# EAGLE schematic power (EAGLE 6.5.0)

## Sheet 1 of 2
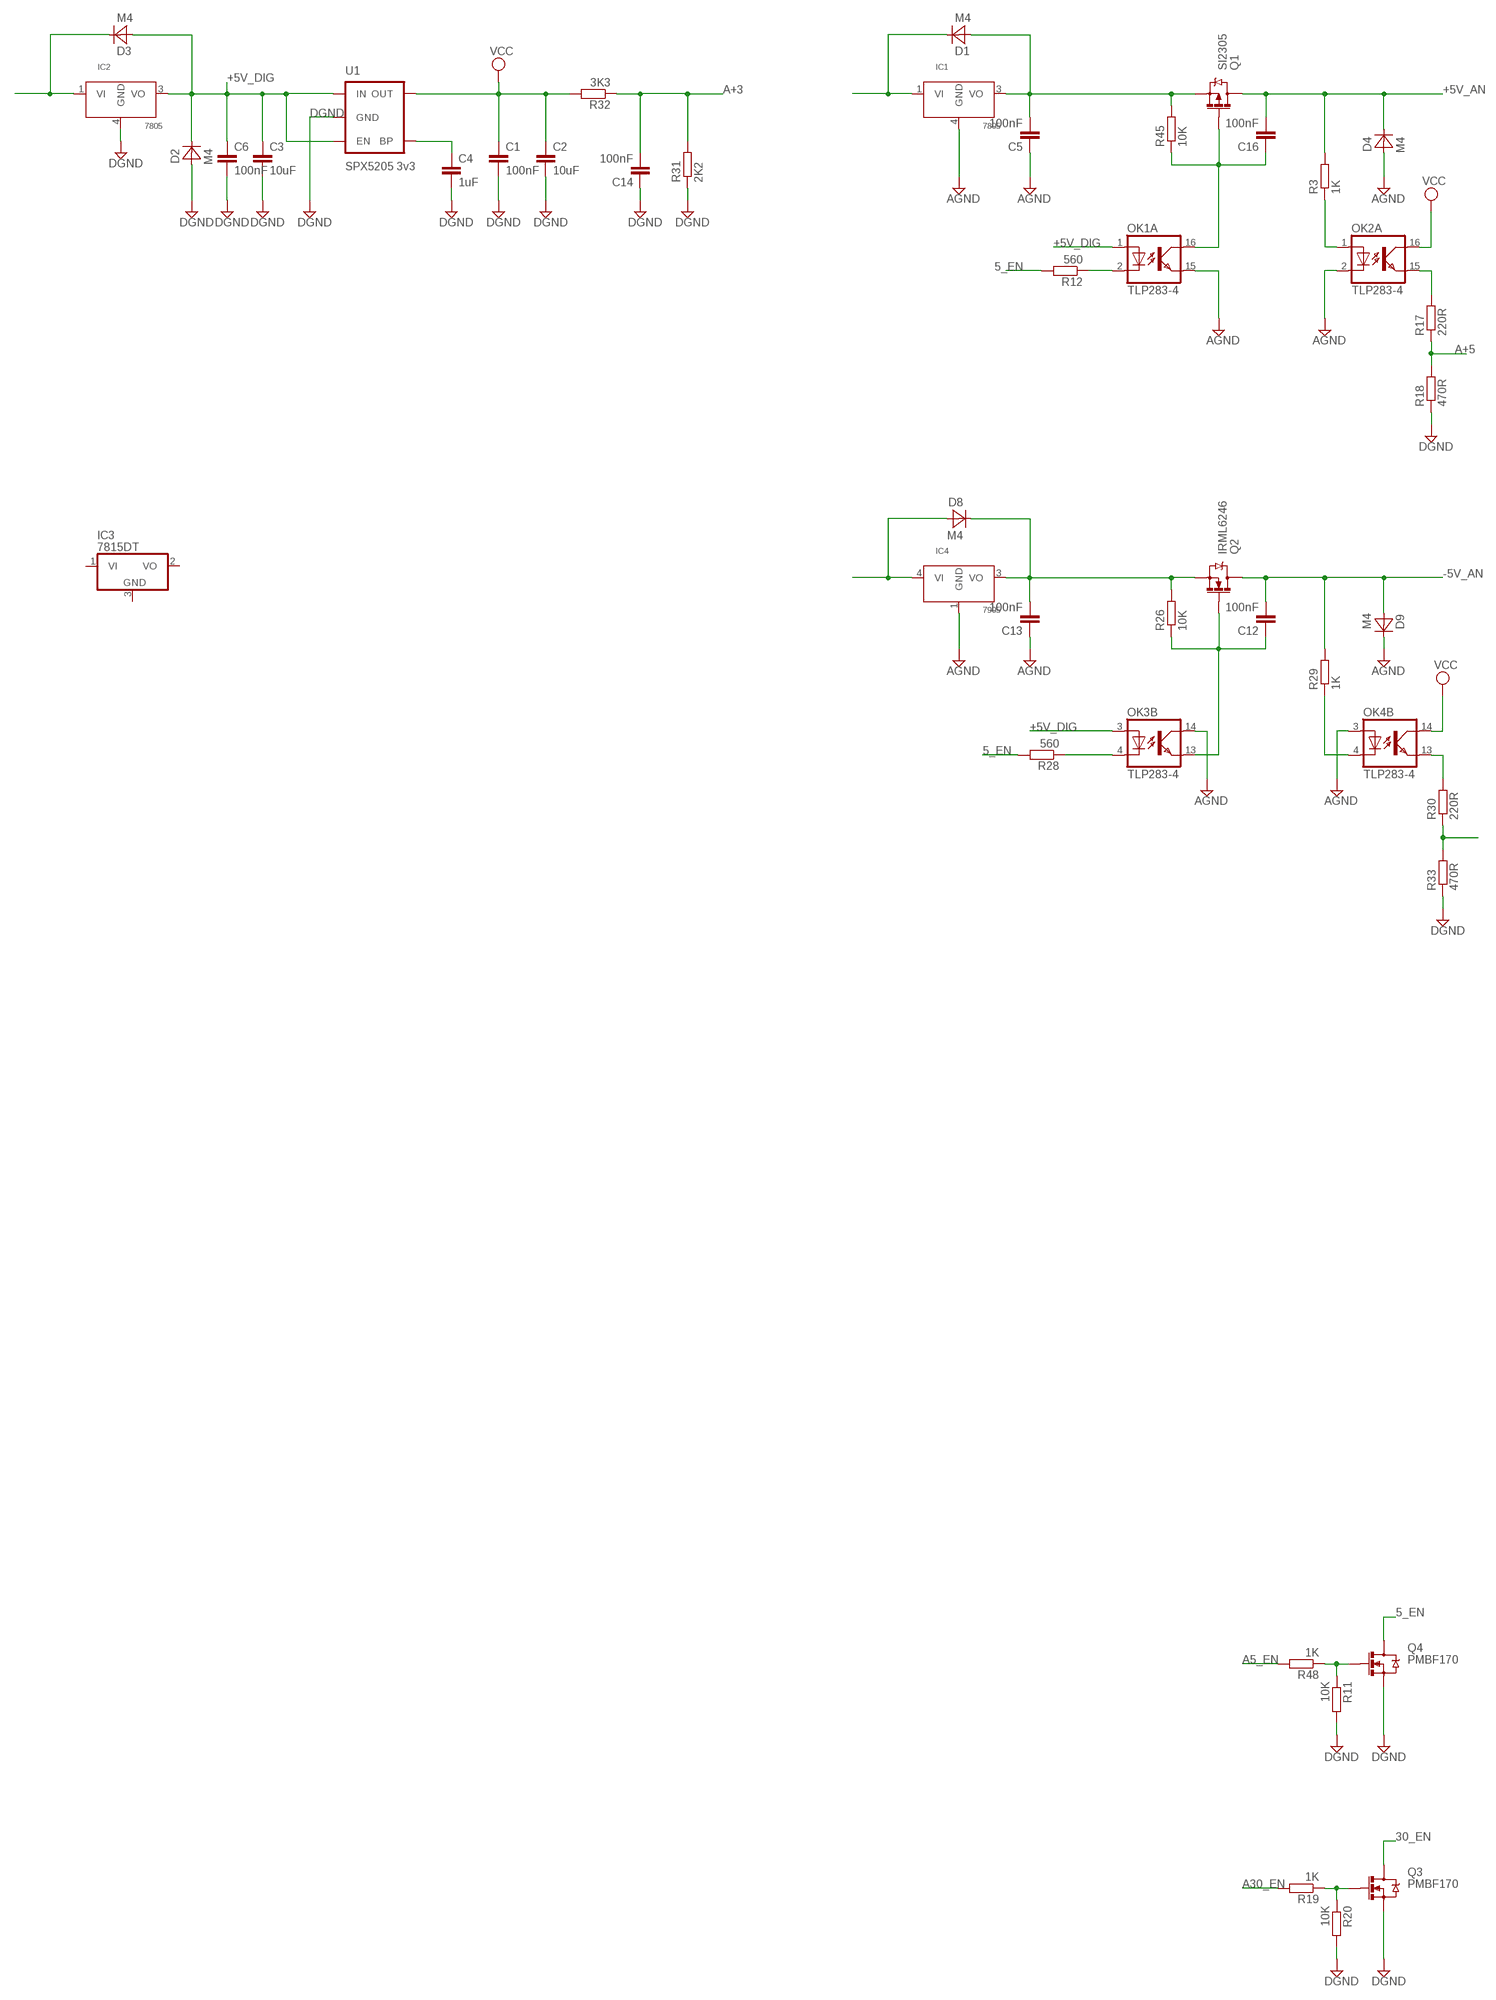
[diagram p0: schematic, sheet 1, part 1 of 2]
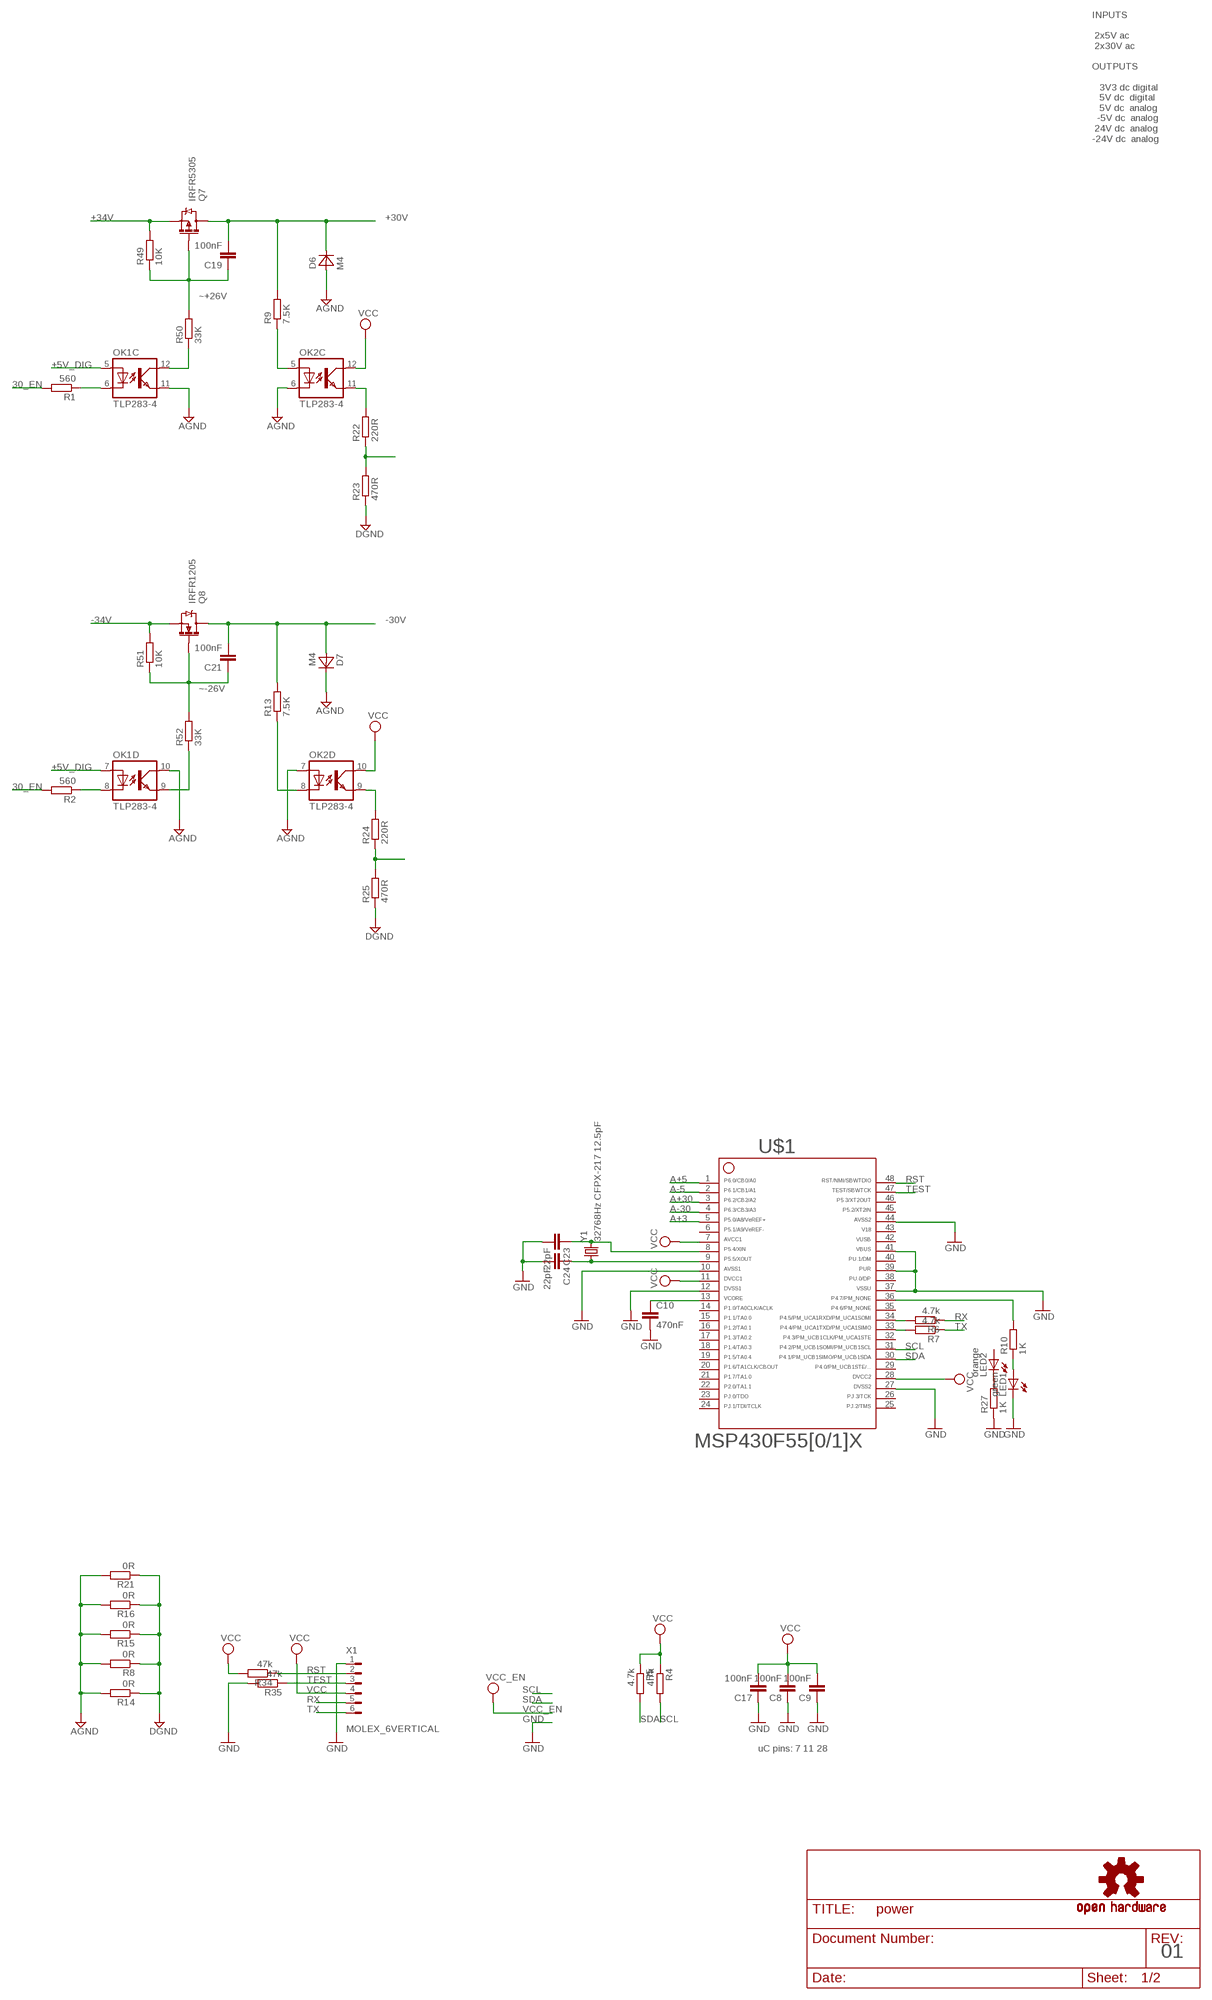
[diagram p1: schematic, sheet 1, part 2 of 2]

### Parts
C1  100nF  C-EUC0805  [C0805]
C2  10uF  C-EUC1206  [C1206]
C3  10uF  C-EUC1206  [C1206]
C4  1uF  C-EUC0805  [C0805]
C5  100nF  C-EUC0805  [C0805]
C6  100nF  C-EUC0805  [C0805]
C8  100nF  C-EUC0805  [C0805]
C9  100nF  C-EUC0805  [C0805]
C10  470nF  C-EUC0805  [C0805]
C12  100nF  C-EUC0805  [C0805]
C13  100nF  C-EUC0805  [C0805]
C14  100nF  C-EUC0805  [C0805]
C16  100nF  C-EUC0805  [C0805]
C17  100nF  C-EUC0805  [C0805]
C19  100nF  C-EUC0805  [C0805]
C21  100nF  C-EUC0805  [C0805]
C23  22pF  C-EUC0805  [C0805]
C24  22pF  C-EUC0805  [C0805]
D1  M4  MBRA340T3  [SMA]
D2  M4  MBRA340T3  [SMA]
D3  M4  MBRA340T3  [SMA]
D4  M4  MBRA340T3  [SMA]
D6  M4  MBRA340T3  [SMA]
D7  M4  MBRA340T3  [SMA]
D8  M4  MBRA340T3  [SMA]
D9  M4  MBRA340T3  [SMA]
IC1  7805  78XX  [D2PACK]
IC2  7805  78XX  [D2PACK]
IC3  7815DT  [TO252]
IC4  7905  79XX  [D2PACK]
LED1  green  LEDCHIP-LED0805  [CHIP-LED0805]
LED2  orange  LEDCHIP-LED0805  [CHIP-LED0805]
OK1  TLP283-4  [MINI-FLAT-16]
OK2  TLP283-4  [MINI-FLAT-16]
OK3  TLP283-4  [MINI-FLAT-16]
OK4  TLP283-4  [MINI-FLAT-16]
Q1  SI2305  MOSFET-PCHANNEL_SOT23-3_POWER  [SOT23-3_POWER]
Q2  IRML6246  MOSFET-NCHANNEL_SOT23-3_POWER  [SOT23-3_POWER]
Q3  PMBF170  MOSFET-NCHANNEL_SOT23-3  [SOT23-3]
Q4  PMBF170  MOSFET-NCHANNEL_SOT23-3  [SOT23-3]
Q7  IRFR5305  MOSFET-PCHANNEL_D-PAK  [D-PAK_TO252AA]
Q8  IRFR1205  MOSFET-NCHANNEL_D-PAK  [D-PAK_TO252AA]
R1  560  R-EU_R0805W  [R0805W]
R2  560  R-EU_R0805W  [R0805W]
R3  1K  R-EU_R0805W  [R0805W]
R4  4.7k  R-EU_R0805W  [R0805W]
R5  4.7k  R-EU_R0805W  [R0805W]
R6  4.7k  R-EU_R0805W  [R0805W]
R7  4.7k  R-EU_R0805W  [R0805W]
R8  0R  R-EU_R0805W  [R0805W]
R9  7.5K  R-EU_R0805W  [R0805W]
R10  1K  R-EU_R0805W  [R0805W]
R11  10K  R-EU_R0805W  [R0805W]
R12  560  R-EU_R0805W  [R0805W]
R13  7.5K  R-EU_R0805W  [R0805W]
R14  0R  R-EU_R0805W  [R0805W]
R15  0R  R-EU_R0805W  [R0805W]
R16  0R  R-EU_R0805W  [R0805W]
R17  220R  R-EU_R0805W  [R0805W]
R18  470R  R-EU_R0805W  [R0805W]
R19  1K  R-EU_R0805W  [R0805W]
R20  10K  R-EU_R0805W  [R0805W]
R21  0R  R-EU_R0805W  [R0805W]
R22  220R  R-EU_R0805W  [R0805W]
R23  470R  R-EU_R0805W  [R0805W]
R24  220R  R-EU_R0805W  [R0805W]
R25  470R  R-EU_R0805W  [R0805W]
R26  10K  R-EU_R0805W  [R0805W]
R27  1K  R-EU_R0805W  [R0805W]
R28  560  R-EU_R0805W  [R0805W]
R29  1K  R-EU_R0805W  [R0805W]
R30  220R  R-EU_R0805W  [R0805W]
R31  2K2  R-EU_R0805W  [R0805W]
R32  3K3  R-EU_R0805W  [R0805W]
R33  470R  R-EU_R0805W  [R0805W]
R34  47k  R-EU_R0805W  [R0805W]
R35  47k  R-EU_R0805W  [R0805W]
R45  10K  R-EU_R0805W  [R0805W]
R48  1K  R-EU_R0805W  [R0805W]
R49  10K  R-EU_R0805W  [R0805W]
R50  33K  R-EU_R0805W  [R0805W]
R51  10K  R-EU_R0805W  [R0805W]
R52  33K  R-EU_R0805W  [R0805W]
U1  SPX5205 3v3  V_REG_LDOSMD  [SOT23-5]
U$1  F55[0/1]X---PT48  [PT48]
U$7  OSHW-LOGOM  [OSHW-LOGO-M]
X1  MOLEX_6VERTICAL  [0530470610]
Y1  32768Hz CFPX-217 12.5pF  CRYSTAL3.2X1.5  [CRYSTAL-SMD-3.2X1.5]

### Nets
5_EN: Q4.3(D) R12.2 R28.2
30_EN: Q3.3(D) R1.2 R2.2
$N2: C13.2 D8.C IC4.3(VO) Q2.2(S) R26.2
$N333: C5.2 D1.A IC1.3(VO) Q1.2(S) R45.2
+5V_AN: C16.2 D4.C Q1.3(D) R3.2
+5V_DIG: C3.1 C6.1 D2.C D3.A IC2.3(VO) OK1.1(A:A) OK1.5(C:A) OK1.7(D:A) OK3.3(B:A) U1.1(IN) U1.3(EN)
+30V: C19.2 D6.C Q7.2(D) R9.2
-5V_AN: C12.2 D9.A Q2.3(D) R29.2
-30V: C21.2 D7.A Q8.2(D) R13.2
A5_EN: R48.2
A30_EN: R19.2
A+3: C14.2 R31.2 R32.1 U$1.5
A+5: R17.1 R18.2 U$1.1
A+30: U$1.3
A-5: U$1.2
A-30: U$1.4
AGND: C5.1 C13.1 D4.A D6.A D7.C D9.C IC1.4(GND) IC4.1(GND) OK1.10(D:COL) OK1.11(C:EMIT) OK1.15(A:EMIT) OK2.2(A:C) OK2.6(C:C) OK2.7(D:A) OK3.14(B:COL) OK4.3(B:A) R8.2 R14.2 R15.2 R16.2 R21.2
DGND: C1.2 C2.2 C3.2 C4.2 C6.2 C14.1 D2.A IC2.4(GND) Q3.2(S) Q4.2(S) R8.1 R11.2 R14.1 R15.1 R16.1 R18.1 R20.2 R21.1 R23.1 R25.1 R31.1 R33.1 U1.2(GND)
GND: C8.1 C9.1 C10.2 C17.1 C23.2 C24.2 LED1.C R27.1 R35.2 U$1.10 U$1.12 U$1.27 U$1.37 U$1.39 U$1.41 U$1.44 X1.1
LED: R10.2 U$1.36
N$1: LED1.A R10.1
N$2: C4.1 U1.4(BP)
N$3: D1.C IC1.1(VI)
N$5: Q4.1(G) R11.1 R48.1
N$6: C10.1 U$1.13
N$8: OK1.2(A:C) R12.1
N$10: OK1.8(D:C) R2.1
N$11: R6.2 U$1.34
N$12: OK2.1(A:A) R3.1
N$13: R7.2 U$1.33
N$15: OK2.5(C:A) R9.1
N$16: OK2.8(D:C) R13.1
N$18: Q3.1(G) R19.1 R20.1
N$19: OK1.6(C:C) R1.1
N$20: D3.C IC2.1(VI)
N$21: OK2.15(A:EMIT) R17.2
N$22: C12.1 OK3.13(B:EMIT) Q2.1(G) R26.1
N$25: C24.1 U$1.9 Y1.P$1
N$26: C23.1 U$1.8 Y1.P$2
N$27: OK2.11(C:EMIT) R22.2
N$28: R22.1 R23.2
N$29: OK2.9(D:EMIT) R24.2
N$30: R24.1 R25.2
N$31: D8.A IC4.4(VI)
N$32: OK3.4(B:C) R28.1
N$33: OK4.4(B:C) R29.1
N$34: OK4.13(B:EMIT) R30.2
N$35: R30.1 R33.2
N$38: C16.1 OK1.16(A:COL) Q1.1(G) R45.1
N$39: LED2.C R27.2
N$40: Q7.3(S) R49.2
N$44: C19.1 Q7.1(G) R49.1 R50.2
N$45: OK1.12(C:COL) R50.1
N$47: Q8.3(S) R51.2
N$49: C21.1 Q8.1(G) R51.1 R52.2
N$50: OK1.9(D:EMIT) R52.1
RST: R34.1 U$1.48 X1.2
RX: R6.1 X1.5
SCL: R4.2 U$1.31
SDA: R5.2 U$1.30
TEST: R35.1 U$1.47 X1.3
TX: R7.1 X1.6
VCC: C1.1 C2.1 C8.2 C9.2 C17.2 OK2.10(D:COL) OK2.12(C:COL) OK2.16(A:COL) OK4.14(B:COL) R4.1 R5.1 R32.2 R34.2 U1.5(OUT) U$1.7 U$1.11 U$1.28 X1.4
Unconnected: IC3.1(VI) IC3.2(VO) IC3.3(GND) LED2.A OK1.3(B:A) OK1.4(B:C) OK1.13(B:EMIT) OK1.14(B:COL) OK2.3(B:A) OK2.4(B:C) OK2.13(B:EMIT) OK2.14(B:COL) OK3.1(A:A) OK3.2(A:C) OK3.5(C:A) OK3.6(C:C) OK3.7(D:A) OK3.8(D:C) OK3.9(D:EMIT) OK3.10(D:COL) OK3.11(C:EMIT) OK3.12(C:COL) OK3.15(A:EMIT) OK3.16(A:COL) OK4.1(A:A) OK4.2(A:C) OK4.5(C:A) OK4.6(C:C) OK4.7(D:A) OK4.8(D:C) OK4.9(D:EMIT) OK4.10(D:COL) OK4.11(C:EMIT) OK4.12(C:COL) OK4.15(A:EMIT) OK4.16(A:COL) U$1.6 U$1.14 U$1.15 U$1.16 U$1.17 U$1.18 U$1.19 U$1.20 U$1.21 U$1.22 U$1.23 U$1.24 U$1.25 U$1.26 U$1.29 U$1.32 U$1.35 U$1.38 U$1.40 U$1.45

### Notes on the sheet
- INPUTS
  
   2x5V ac
   2x30V ac
  
  OUTPUTS
  
     3V3 dc digital
     5V dc  digital
     5V dc  analog
    -5V dc  analog
   24V dc  analog
  -24V dc  analog
- +34V
- ~+26V
- -34V
- ~-26V
- uC pins: 7 11 28
- 01

## Sheet 2 of 2

## Power pins joined to a net without a drawn wire
42: U$1.42
43: U$1.43
46: U$1.46

## Library data of the parts
C1-C6 C8-C10 C12-C14 C16 C17 C19 C21 C23 C24 = rcl:C-EU: CAPACITOR, European symbol
D1-D4 D6-D9 = diode:MBRA340T3: Surface Mount Schottky Power Rectifier Source: http://www.onsemi.com/pub_link/Collateral/MBRA340T3-D.PDF
IC1 IC2 = Simplex-ICs:78XX: 78xx positive voltage linear regulators
IC3 = linear:78*: Positive VOLTAGE REGULATOR Source: http://cache.national.com/ds/LM/LM78L05.pdf http://www.fairchildsemi.com/ds/LM/LM7805.pdf
IC4 = Simplex-ICs:79XX: 79xx negative voltage linear regulators
LED1 LED2 = led:LED: LED OSRAM: - CHIPLED LG R971, LG N971, LY N971, LG Q971, LY Q971, LO R971, LY R971 LH N974, LH R974 LS Q976, LO Q976, LY Q976 LO Q996 - Hyper CHIPLED LW Q18S LB Q993, LB Q99A, LB R99A - SideLED LS A670, LO A670, LY A670, LG A670, LP A670 LB A673, LV A673, LT A673, LW A673 LH A674 LY A675 LS A676, LA A676, LO A676, LY A676, LW A676 LS A679, LY A679, LG A679 - Hyper Micro SIDELED® LS Y876, LA Y876, LO Y876, LY Y876 LT Y87S - SmartLED LW L88C, LW L88S LB L89C, LB L89S, LG L890 LS L89K, LO L89K, LY L89K LS L896, LA L896, LO L896, LY L896 - TOPLED LS T670, LO T670, LY T670, LG T670, LP T670 LSG T670, LSP T670, LSY T670, LOP T670, LYG T670 LG T671, LOG T671, LSG T671 LB T673, LV T673, LT T673, LW T673 LH T674 LS T676, LA T676, LO T676, LY T676, LB T676, LH T676, LSB T676, LW T676 LB T67C, LV T67C, LT T67C, LS T67K, LO T67K, LY T67K, LW E67C LS E67B, LA E67B, LO E67B, LY E67B, LB E67C, LV E67C, LT E67C LW T67C LS T679, LY T679, LG T679 LS T770, LO T770, LY T770, LG T770, LP T770 LB T773, LV T773, LT T773, LW T773 LH T774 LS E675, LA E675, LY E675, LS T675 LS T776, LA T776, LO T776, LY T776, LB T776 LHGB T686 LT T68C, LB T68C - Hyper Mini TOPLED® LB M676 - Mini TOPLED Santana® LG M470 LS M47K, LO M47K, LY M47K Source: http://www.osram.convergy.de LUXEON: - LUMILED® LXK2-PW12-R00, LXK2-PW12-S00, LXK2-PW14-U00, LXK2-PW14-V00 LXK2-PM12-R00, LXK2-PM12-S00, LXK2-PM14-U00 LXK2-PE12-Q00, LXK2-PE12-R00, LXK2-PE12-S00, LXK2-PE14-T00, LXK2-PE14-U00 LXK2-PB12-K00, LXK2-PB12-L00, LXK2-PB12-M00, LXK2-PB14-N00, LXK2-PB14-P00, LXK2-PB14-Q00 LXK2-PR12-L00, LXK2-PR12-M00, LXK2-PR14-Q00, LXK2-PR14-R00 LXK2-PD12-Q00, LXK2-PD12-R00, LXK2-PD12-S00 LXK2-PH12-R00, LXK2-PH12-S00 LXK2-PL12-P00, LXK2-PL12-Q00, LXK2-PL12-R00 Source: www.luxeon.com KINGBRIGHT: KA-3528ASYC Source: www.kingbright.com
OK1-OK4 = optocoupler:TLP283-4: TOSHIBA PHOTOCOUPLER GaAs IRED & PHOTO-TRANSISTOR Source: http://www.semicon.toshiba.co.jp/td/en/Opto/Photocoupler/en_20050928_TLP283_datasheet.pdf; OC_FARNELL: unknown; OC_NEWARK: unknown
Q1 Q7 = Simplex-DiscreteSemi:MOSFET-PCHANNEL: Generic P-channel mosfet
Q2-Q4 Q8 = Simplex-DiscreteSemi:MOSFET-NCHANNEL: Generic N-channel mosfet
R1-R35 R45 R48-R52 = rcl:R-EU_: RESISTOR, European symbol
U1 = SparkFun:V_REG_LDO: Voltage Regulator LDO Standard 150mA LDO voltage regulator in SOT-23 layout. Micrel part MIC5205. BP (by-pass) pin is used to lower output noise with 470pF cap.
U$1 = TI_MSP430_v16:F55[0/1]X---PT48: ***F55[0/1/2]X*** PT48 Rev. 1.0 06/2010 "http://www.ti.com/lit/gpn/msp430f5509" Only for FF5504, F5508,F5509,F5510
U$7 = SparkFun:OSHW-LOGO: Open Source Hardware Logo This logo indicates the piece of hardware it is found on incorporates a OSHW license and/or adheres to the definition of open source hardware found here: http://freedomdefined.org/OSHW
X1 = Simplex-Connectors:MOLEX_6: Molex 6 pin connectors 1.25mm PicoBlade
Y1 = Simplex-FreqCtrl:CRYSTAL: smd crystals

## Net classes
1 vcc: width 0.203 mm